# EAGLE design airButtonSwitch (EAGLE 9.6.2)
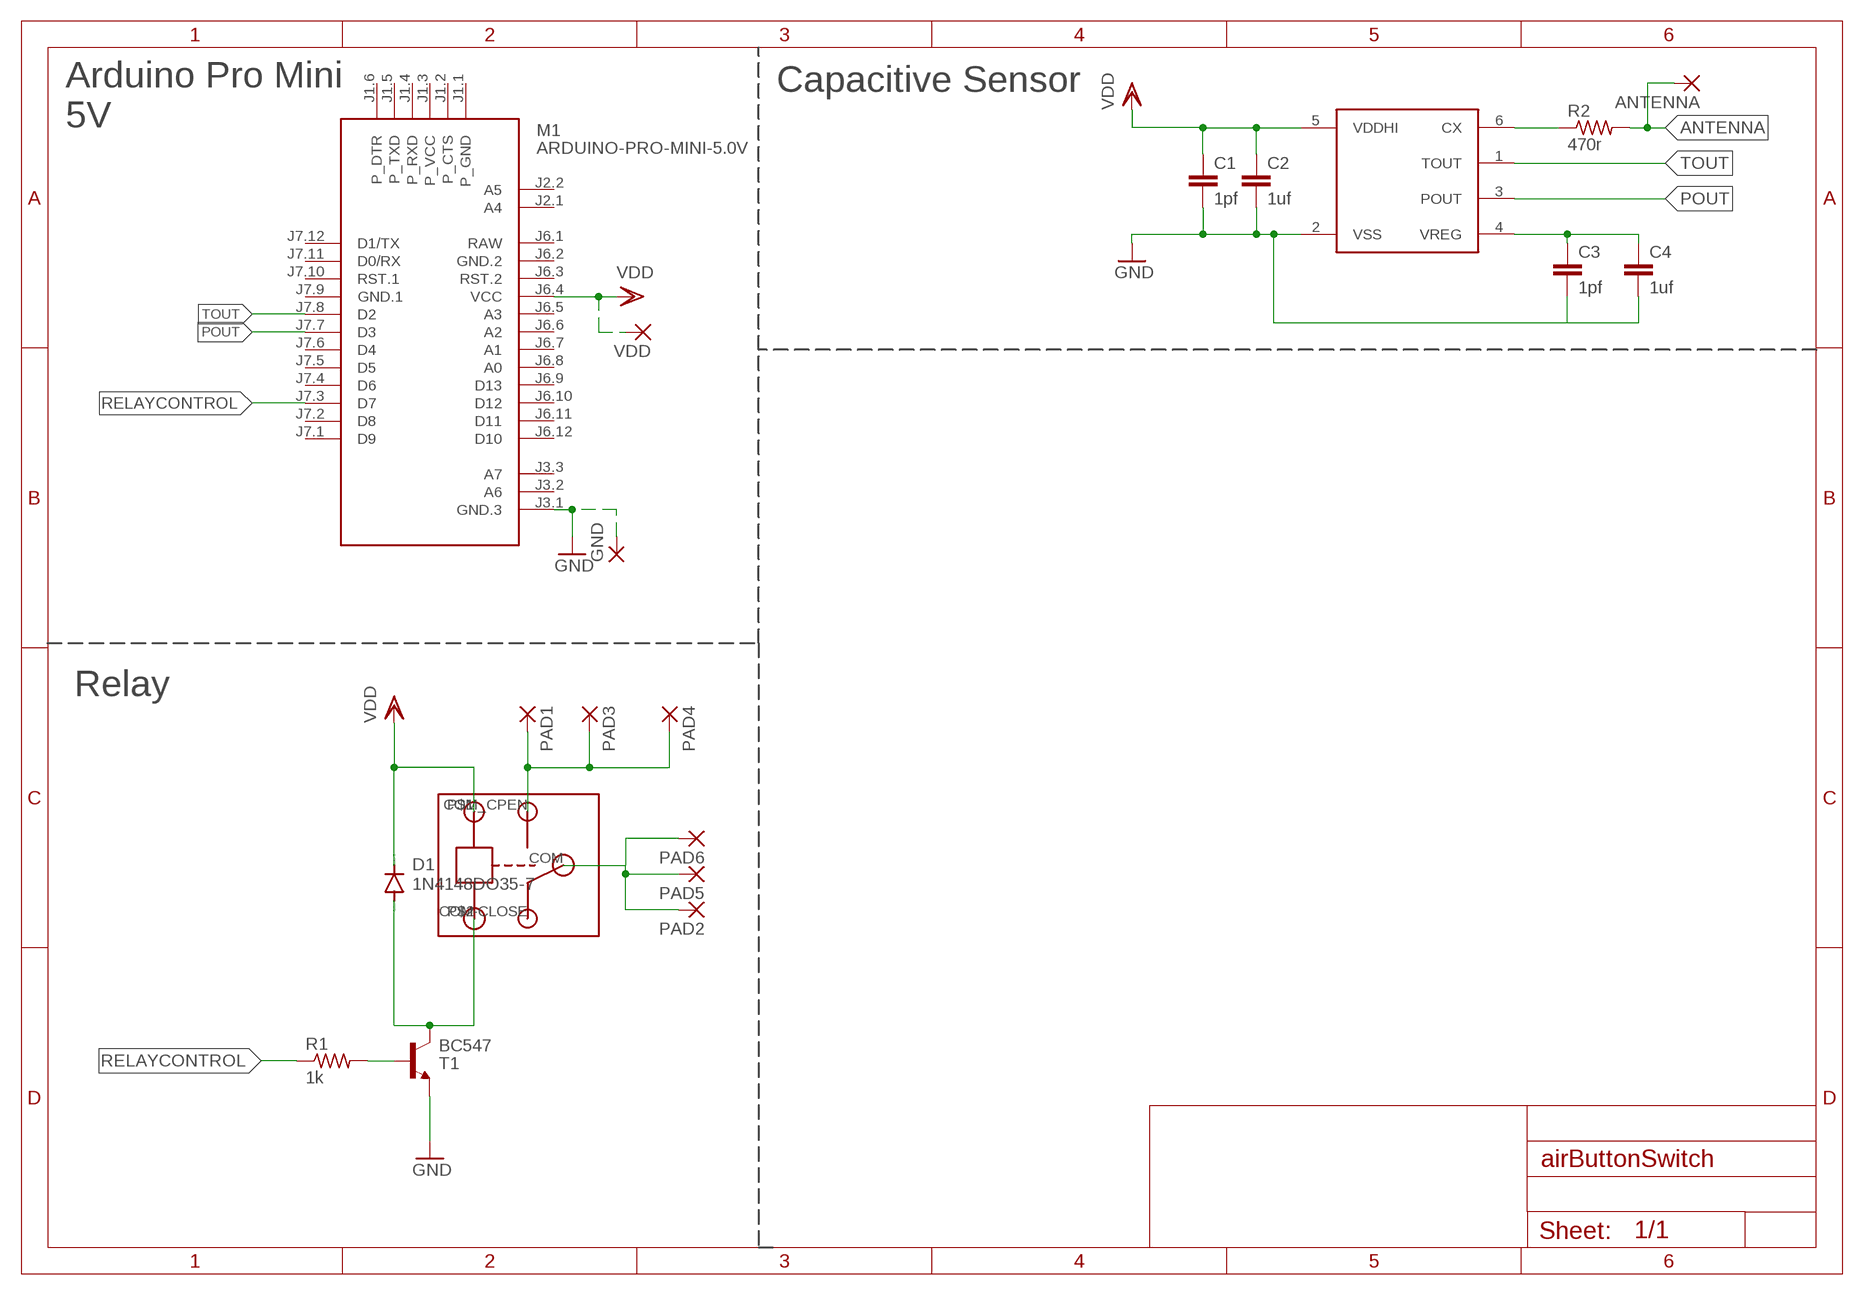
[diagram p0: schematic, sheet 1]

## Parts
ANTENNA  2,54/1,0  [2,54/1,0]
C1  1pf  C-EUC0805  [C0805]
C2  1uf  C-EUC0805  [C0805]
C3  1pf  C-EUC0805  [C0805]
C4  1uf  C-EUC0805  [C0805]
D1  1N4148DO35-7  [DO35-7]
GND  2,54/1,0  [2,54/1,0]
M1  ARDUINO-PRO-MINI-5.0V  [ARDUINO-PRO-MINI]
PAD1  2,54/1,0  [2,54/1,0]
PAD2  2,54/1,0  [2,54/1,0]
PAD3  2,54/1,0  [2,54/1,0]
PAD4  2,54/1,0  [2,54/1,0]
PAD5  2,54/1,0  [2,54/1,0]
PAD6  2,54/1,0  [2,54/1,0]
R1  1k  R-US_0309/10  [0309/10]
R2  470r  R-US_R0805  [R0805]
T1  BC547  [TO92]
U$1  IQS127D  [SOT23-6]
U$2  RELAY  [RELAY]
VDD  2,54/1,0  [2,54/1,0]

## Nets
ANTENNA: ANTENNA.1(P) R2.2
GND: C1.2 C2.2 C3.2 C4.2 GND.1(P) M1.J3.1(GND.3) T1.1(E) U$1.2(VSS)
N$1: R1.2 T1.2(B)
N$2: D1.A T1.3(C) U$2.P$2(GND)
N$3: R2.1 U$1.6(CX)
N$5: PAD1.1(P) PAD3.1(P) PAD4.1(P) U$2.COM_CPEN(COM-OPEN)
N$6: C3.1 C4.1 U$1.4(VREG)
N$8: PAD2.1(P) PAD5.1(P) PAD6.1(P) U$2.COM
POUT: M1.J7.7(D3) U$1.3(POUT)
RELAYCONTROL: M1.J7.3(D7) R1.1
TOUT: M1.J7.8(D2) U$1.1(TOUT)
VDD: C1.1 C2.1 D1.C M1.J6.4(VCC) U$1.5(VDDHI) U$2.P$1(IN) VDD.1(P)
Unconnected: M1.J1.1(P_GND) M1.J1.2(P_CTS) M1.J1.3(P_VCC) M1.J1.4(P_RXD) M1.J1.5(P_TXD) M1.J1.6(P_DTR) M1.J2.1(A4) M1.J2.2(A5) M1.J3.2(A6) M1.J3.3(A7) M1.J6.3(RST.2) M1.J6.5(A3) M1.J6.6(A2) M1.J6.7(A1) M1.J6.8(A0) M1.J6.9(D13) M1.J6.10(D12) M1.J6.11(D11) M1.J6.12(D10) M1.J7.1(D9) M1.J7.2(D8) M1.J7.4(D6) M1.J7.5(D5) M1.J7.6(D4) M1.J7.10(RST.1) M1.J7.11(D0/RX) M1.J7.12(D1/TX) U$2.COM-CLOSE

## Notes on the sheet
- Capacitive Sensor
- Arduino Pro Mini
  5V
- Relay

## Power pins joined to a net without a drawn wire
GND.1: M1.J7.9(GND.1)
GND.2: M1.J6.2(GND.2)
RAW: M1.J6.1(RAW)

## Library data of the parts
ANTENNA GND PAD1-PAD6 VDD = wirepad:2,54/1,0: THROUGH-HOLE PAD
C1-C4 = rcl:C-EU: CAPACITOR, European symbol; SPICEPREFIX: C
D1 = diode:1N4148: DIODE high speed (Philips)
M1 = diy-modules:ARDUINO-PRO-MINI-*: Arduino Pro Mini and compatible devices More details available here: https://www.arduino.cc/en/Main/ArduinoBoardProMini Click here to find device on ebay.com <http://www.ebay.com/sch/arduino+pro+mini>
R1 = resistor:R-US_: RESISTOR, American symbol
R2 = rcl:R-US_: RESISTOR, American symbol; SPICEPREFIX: R
T1 = transistor:BC547: NPN TRANSISTOR
U$1 = IQS127D:IQS127D: IQS127D The IQS127D ProxSense® IC is a fully integrated capacitive sensor with dual outputs (Touch and Proximity outputs).
U$2 = RELAY:RELAY

## Net classes
0 default: width 0.508 mm, drill 0.025 mm, clearance 0.254 mm

## Board
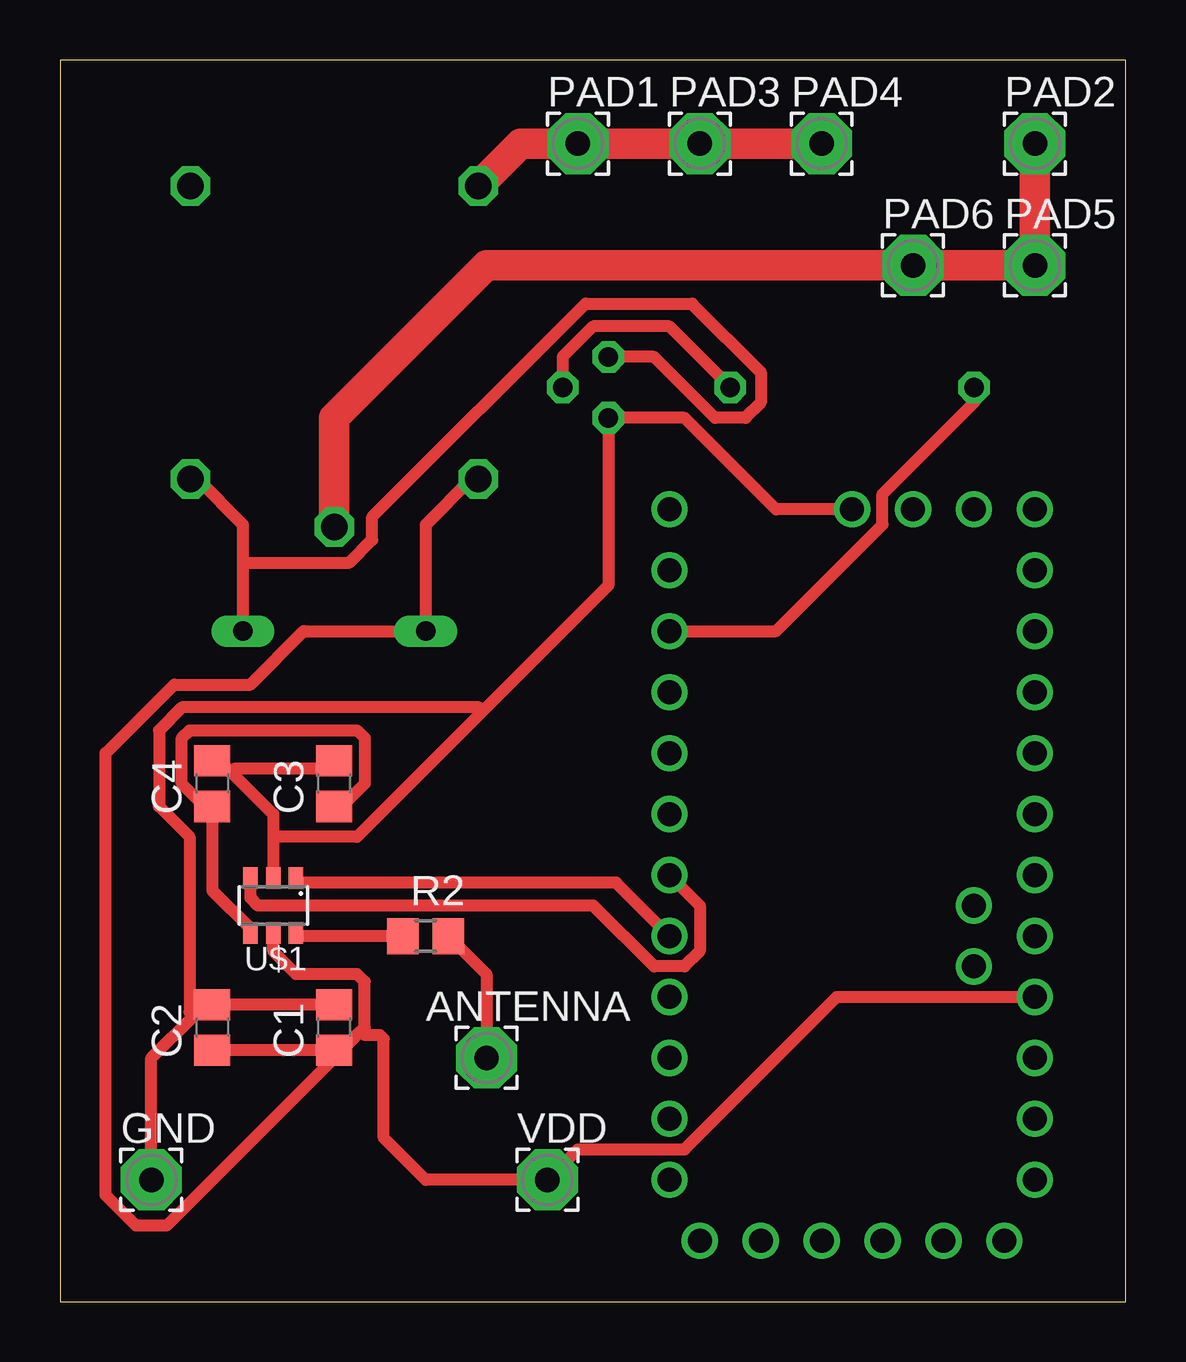
[diagram p1: board, top side]
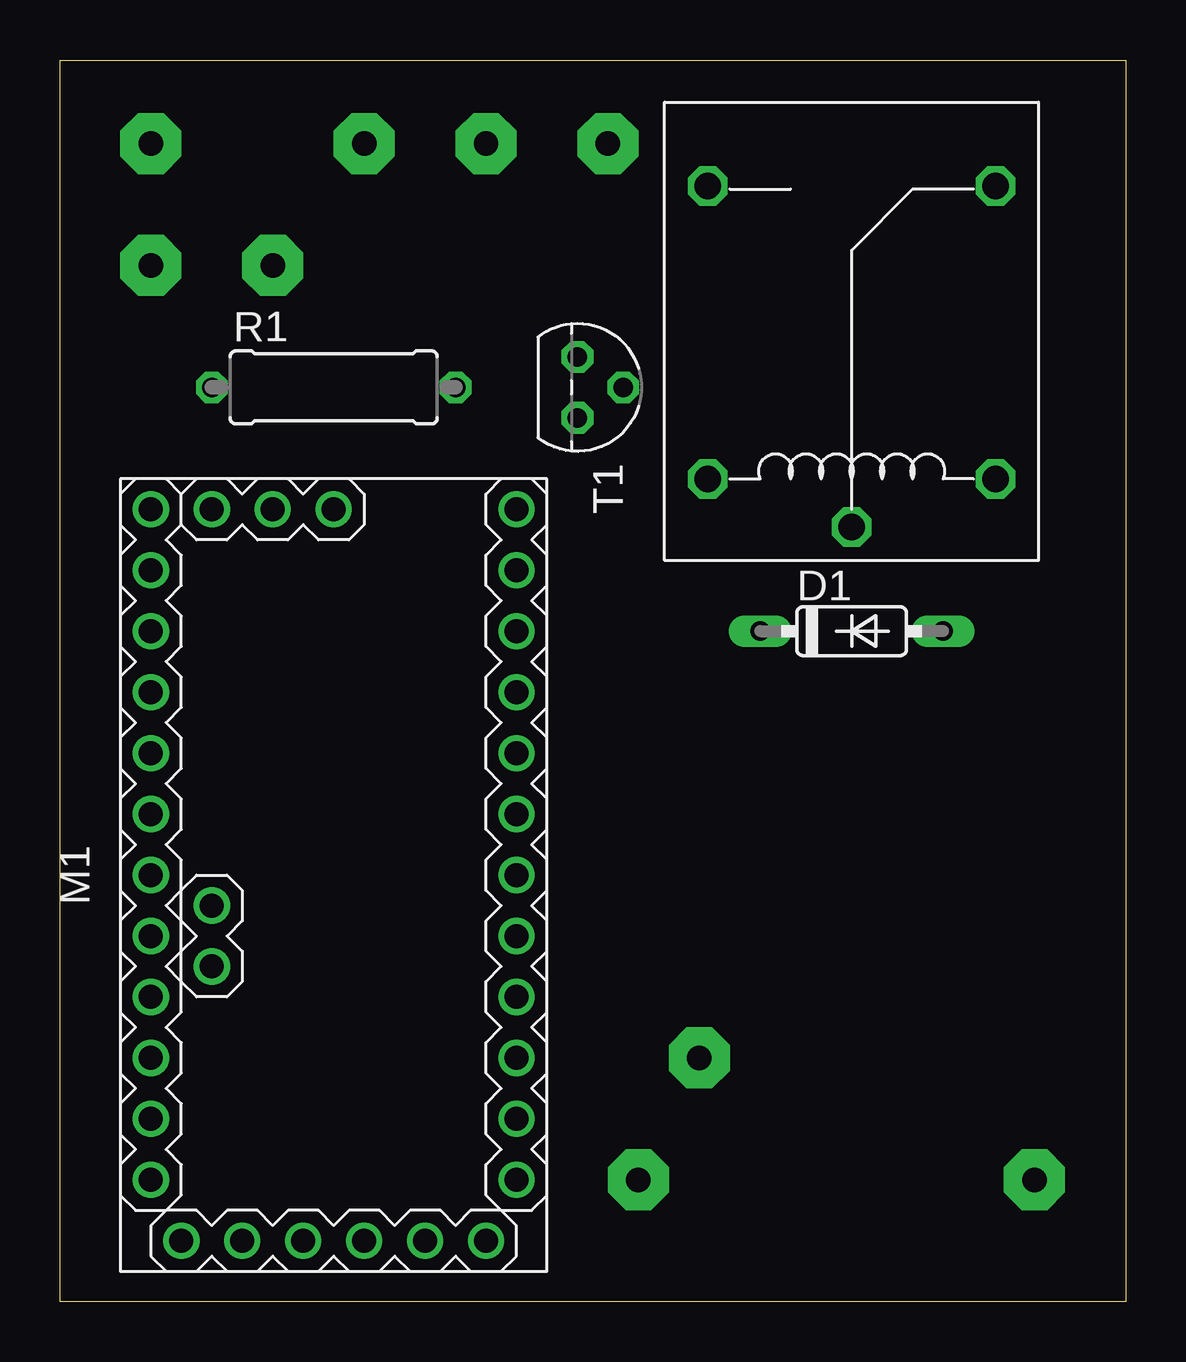
[diagram p2: board, bottom side, seen from below]

Size 44.43 x 51.74 mm. Coordinates in mm from the lower left corner, seen from the top.
Outline: 0,0 44.43,0 44.43,51.74 0,51.74 0,0
Copper layers (1*16): Top 0.035mm / dielectric 1.5mm / Bottom 0.035mm
Design rules "default": minimum track width 6mil, minimum drill 0.35mm, track to track 6mil, track to pad 6mil, pad to pad 6mil, via to via 6mil, smd to smd 6mil, copper to edge 40mil, drill to drill 6mil, minimum pad ring 10mil, minimum via ring 8mil, stop-mask expansion 4mil, vias tented up to drill 0mil, thermal gap 10mil

### Footprints (pad centres in the part's own frame; a part is rotated, then mirrored left to right if it is on the bottom)
2,54/1,0 = drill 1.016 pad 2.54 octagon: 1 0,0
C0805 = smd 1.3 x 1.5: 1 -0.95,0; 2 0.95,0
DO35-7 = drill 0.813 long: A 3.81,0; C -3.81,0
ARDUINO-PRO-MINI = drill 1: J1.1 -15.24,6.35; J1.2 -15.24,3.81; J1.3 -15.24,1.27; J1.4 -15.24,-1.27; J1.5 -15.24,-3.81; J1.6 -15.24,-6.35; J2.1 -1.27,5.08; J2.2 -3.81,5.08; J3.1 15.24,0; J3.2 15.24,2.54; J3.3 15.24,5.08; J6.1 -12.7,7.62; J6.2 -10.16,7.62; J6.3 -7.62,7.62; J6.4 -5.08,7.62; J6.5 -2.54,7.62; J6.6 0,7.62; J6.7 2.54,7.62; J6.8 5.08,7.62; J6.9 7.62,7.62; J6.10 10.16,7.62; J6.11 12.7,7.62; J6.12 15.24,7.62; J7.1 15.24,-7.62; J7.2 12.7,-7.62; J7.3 10.16,-7.62; J7.4 7.62,-7.62; J7.5 5.08,-7.62; J7.6 2.54,-7.62; J7.7 0,-7.62; J7.8 -2.54,-7.62; J7.9 -5.08,-7.62; J7.10 -7.62,-7.62; J7.11 -10.16,-7.62; J7.12 -12.7,-7.62
0309/10 = drill 0.813 octagon: 1 -5.08,0; 2 5.08,0
R0805 = smd 1.3 x 1.5: 1 -0.95,0; 2 0.95,0
TO92 = drill 0.813 octagon: 1 1.27,0; 2 0,1.905; 3 -1.27,0
SOT23-6 = smd 0.6 x 0.9: 1 -0.95,-1.15; 2 0,-1.15; 3 0.95,-1.15; 4 0.95,1.15; 5 0,1.15; 6 -0.95,1.15
RELAY = drill 1.1 octagon: COM -2,0; COM-CLOSE 12.2,-6; COM_CPEN 12.2,6; P$1 0,6; P$2 0,-6

### Placement (x,y rotation side)
ANTENNA  17.78,10.16 0 top
C1  11.43,11.43 90 top
C2  6.35,11.43 90 top
C3  11.43,21.59 90 top
C4  6.35,21.59 90 top
D1  11.43,27.94 0 bottom
GND  3.81,5.08 0 top
M1  33.02,17.78 90 bottom
PAD1  21.59,48.26 0 top
PAD2  40.64,48.26 0 top
PAD3  26.67,48.26 0 top
PAD4  31.75,48.26 0 top
PAD5  40.64,43.18 0 top
PAD6  35.56,43.18 0 top
R1  33.02,38.1 0 bottom
R2  15.24,15.24 0 top
T1  22.86,38.1 270 bottom
U$1  8.89,16.51 180 top
U$2  11.43,34.29 90 bottom
VDD  20.32,5.08 0 top

### Tracks (layer width: path | path; a pad name or v marks a point on that pad's centre or on a via)
ANTENNA
  Top 0.508: R2.2 17.78,13.65 ANTENNA.1
GND
  Top 0.508: C1.2 C2.2 6.35,12.07 5.71,12.07 5.56,11.91 | 5.56,11.91 3.81,10.16 GND.1 | 8.89,19.37 8.89,20.32 7.14,22.07 | 8.89,19.37 U$1.2 | 7.14,22.07 6.99,22.22 6.35,22.22 C4.2 | C3.2 11.43,22.22 7.3,22.22 7.14,22.07 | M1.J3.1 29.84,33.02 26.04,36.83 T1.1 22.86,29.85 17.62,24.61 | 8.89,19.37 12.38,19.37 17.62,24.61 | 5.56,11.91 5.4,12.07 5.4,19.37 4.13,20.64 4.13,23.81 5.08,24.76 17.46,24.76 17.62,24.61
N$1
  Top 0.508: T1.2 20.95,39.37 22.23,40.64 25.4,40.64 R1.2
N$2
  Top 0.508: 7.62,30.8 7.62,32.39 5.71,34.29 U$2.P$2 | 7.62,30.8 D1.A | T1.3 24.77,39.37 27.3,36.83 28.57,36.83 29.21,37.47 29.21,38.73 26.35,41.59 21.91,41.59 13.02,32.7 13.02,31.75 12.06,30.8 7.62,30.8
N$3
  Top 0.508: R2.1 9.84,15.24 U$1.6
N$5
  Top 1.27: U$2.COM_CPEN 19.2,48.26 PAD1.1 PAD3.1 PAD4.1
N$6
  Top 0.508: 6.35,20.32 C4.1 | 6.35,20.32 6.35,17.14 7.94,15.56 U$1.4 | 6.35,20.32 5.08,21.59 5.08,23.5 5.4,23.81 12.38,23.81 12.7,23.5 12.7,21.59 12.06,20.95 11.43,20.95 C3.1
N$8
  Top 1.27: PAD2.1 PAD5.1 PAD6.1 17.78,43.18 11.43,36.83 U$2.COM
POUT
  Top 0.508: M1.J7.7 26.67,16.51 26.67,14.61 26.04,13.97 24.77,13.97 22.23,16.51 8.26,16.51 7.94,16.83 7.94,17.46 U$1.3
RELAYCONTROL
  Top 0.508: R1.1 38.1,37.47 34.29,33.66 34.29,32.39 29.84,27.94 M1.J7.3
TOUT
  Top 0.508: M1.J7.8 23.18,17.46 9.84,17.46 U$1.1
VDD
  Top 0.508: U$2.P$1 17.14,34.29 15.24,32.39 D1.C 10.16,27.94 7.94,25.72 4.76,25.72 1.91,22.86 1.91,4.45 3.17,3.18 4.45,3.18 12.06,10.79 | U$1.5 8.89,14.61 9.84,13.65 12.38,13.65 12.7,13.34 12.7,11.43 12.54,11.27 | 12.06,10.79 12.54,11.27 | 12.06,10.79 11.43,10.79 C1.1 | C2.1 C1.1 | M1.J6.4 32.38,12.7 26.04,6.35 21.59,6.35 VDD.1 15.24,5.08 13.49,6.83 13.49,10.95 13.34,11.11 12.7,11.11 12.54,11.27 | 12.06,10.79 C1.1